# EasyEDA Pro project ProPrj_RGB_AddOn.epro, schematic Schematic1

## Sheets
1 Matrix: Board Name: Board1; Create Date: 2026-03-03; Page Name: Matrix; Project Name: RGB_AddOn; Schematic Name: Schematic1; Update Date: 2026-03-03; Company: EasyEDA.com; Page Size: A4; Version: V1.0
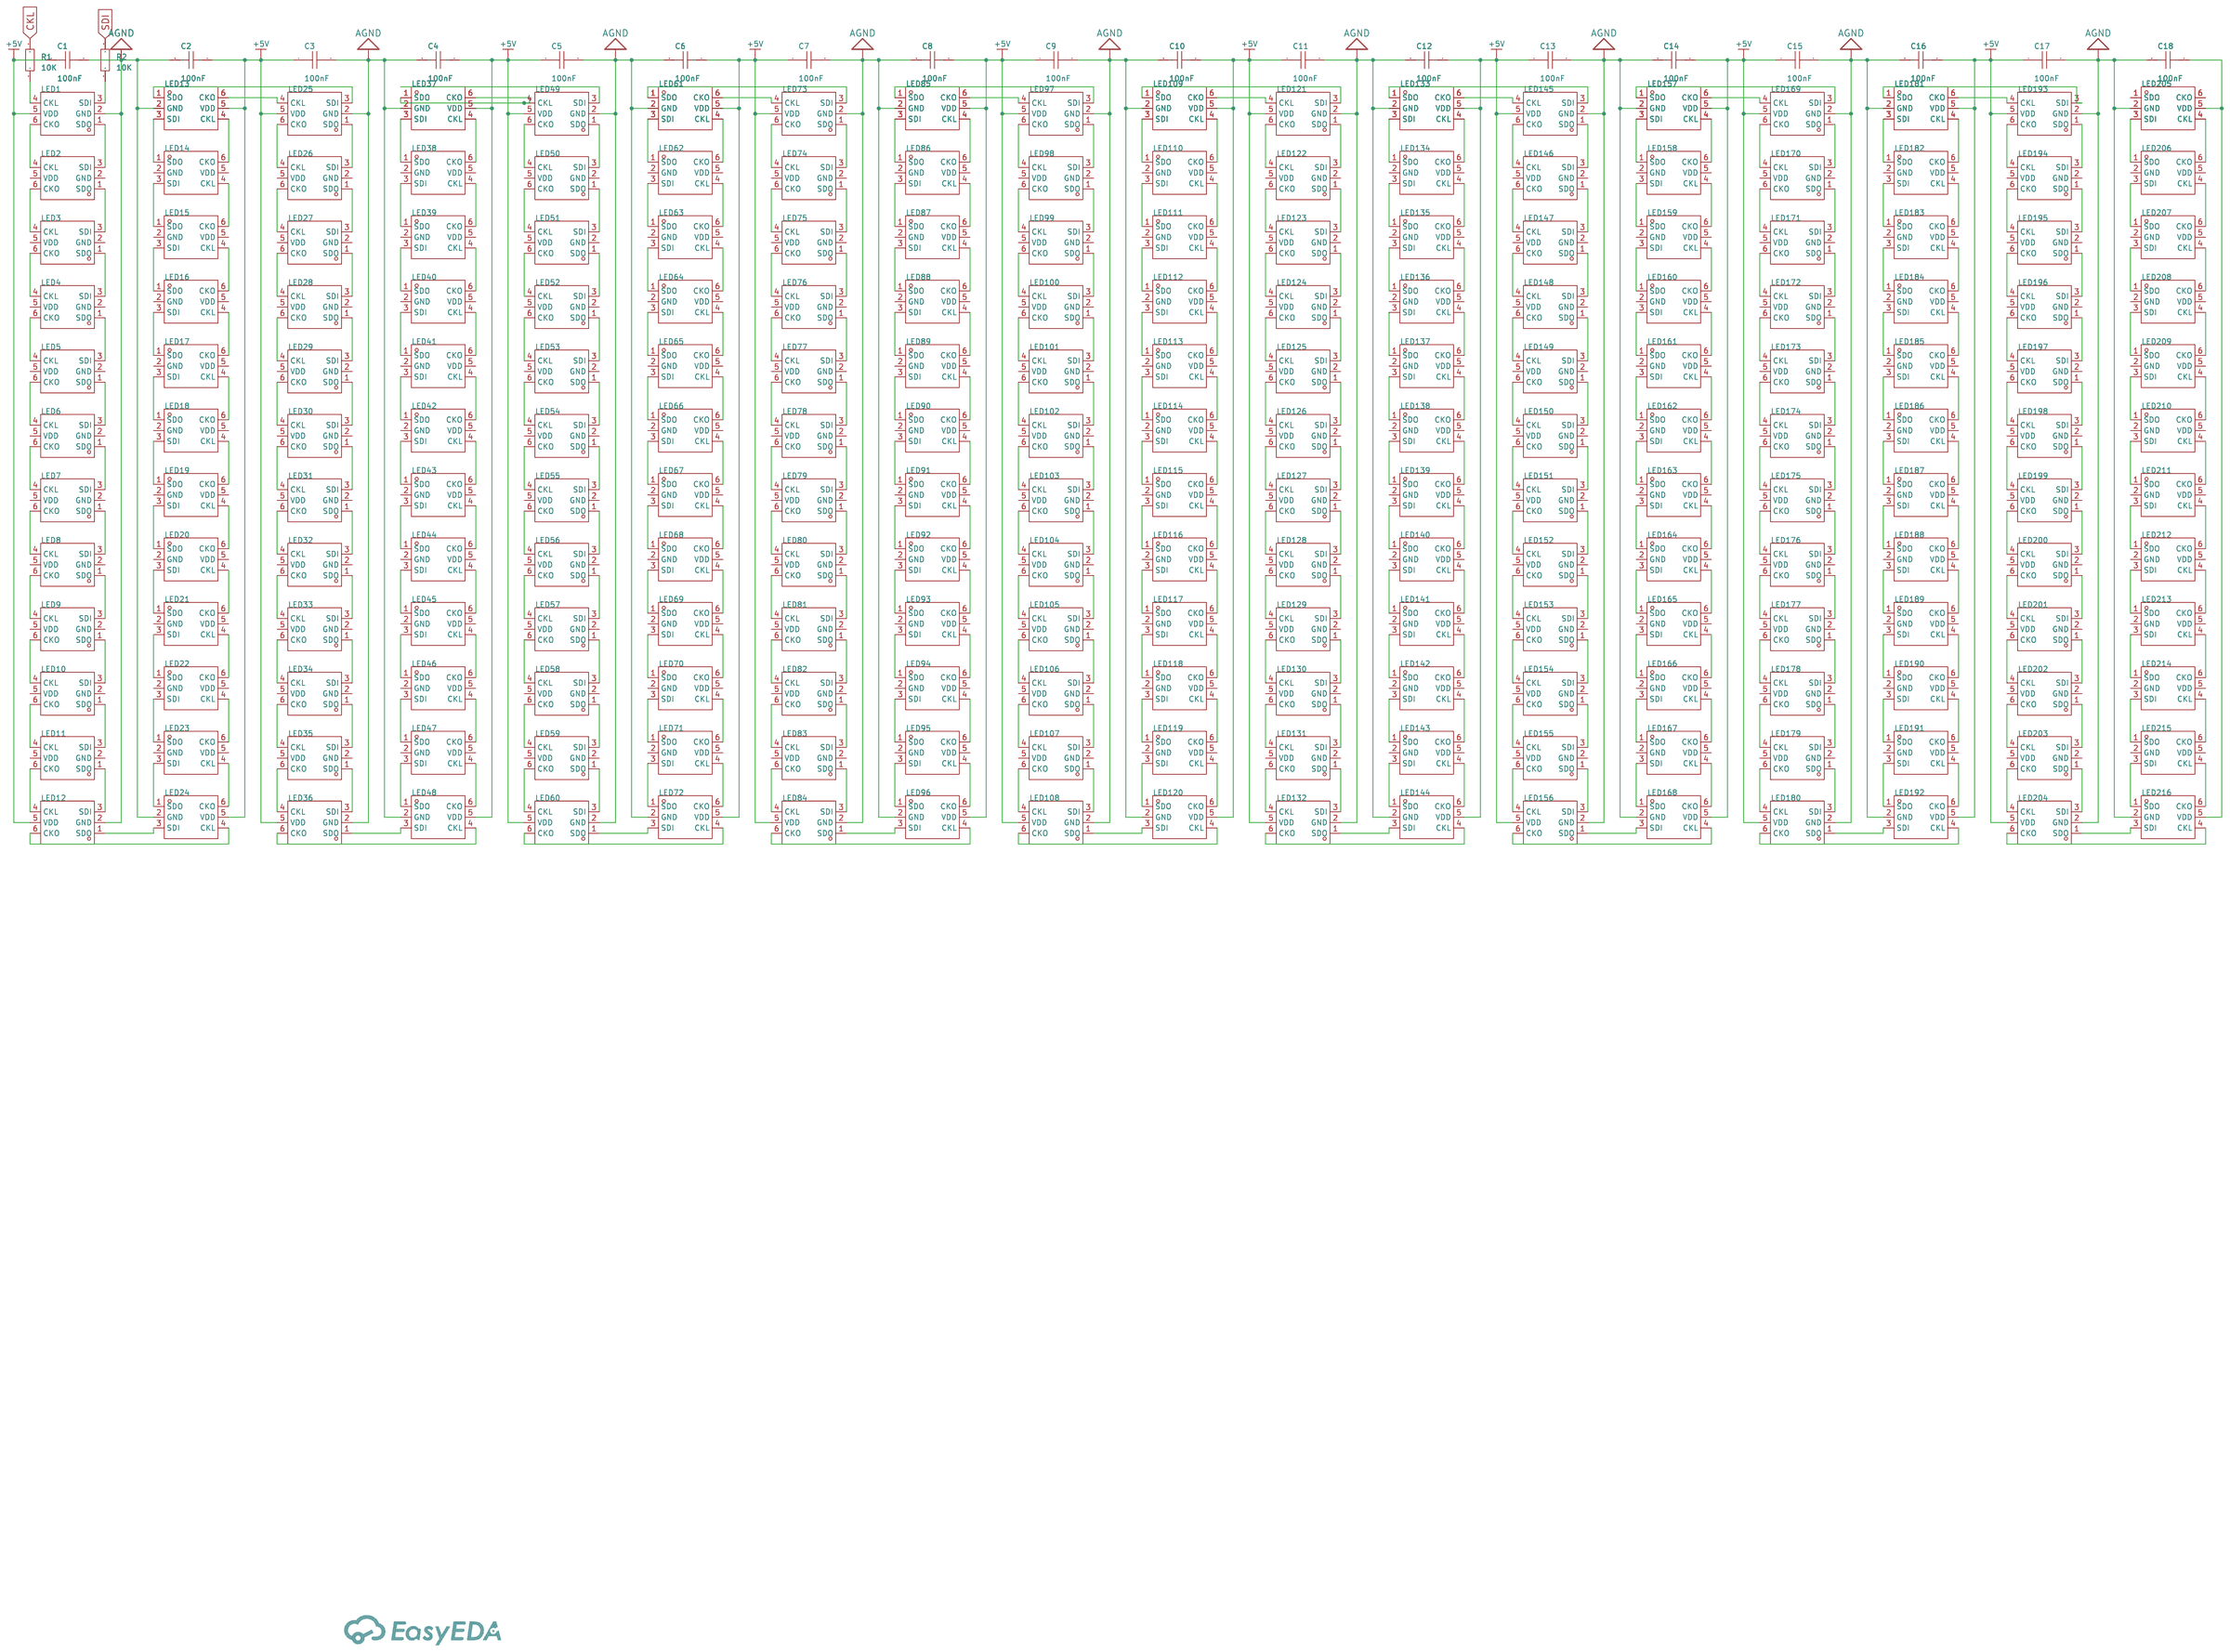
[diagram p0: Matrix]
2 MCU: Create Date: 2026-03-02; Page Name: MCU
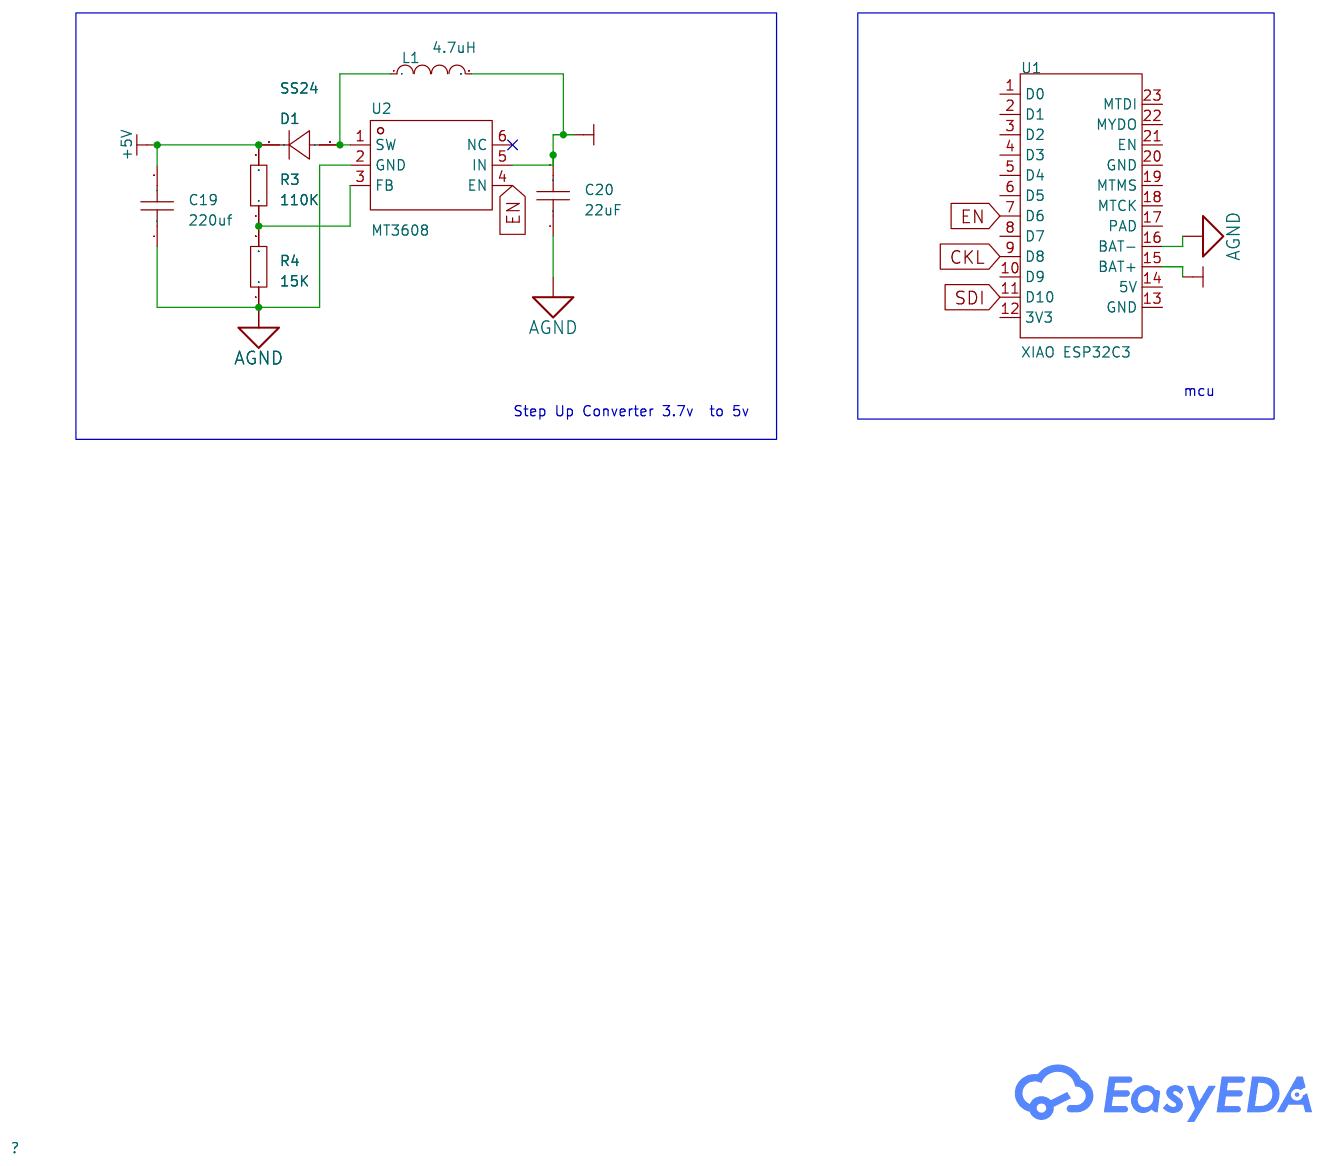
[diagram p1: MCU]

## Parts
sheet Matrix
C1  100nF  [C0603]
C2  100nF  [C0603]
C3  100nF  [C0603]
C4  100nF  [C0603]
C5  100nF  [C0603]
C6  100nF  [C0603]
C7  100nF  [C0603]
C8  100nF  [C0603]
C9  100nF  [C0603]
C10  100nF  [C0603]
C11  100nF  [C0603]
C12  100nF  [C0603]
C13  100nF  [C0603]
C14  100nF  [C0603]
C15  100nF  [C0603]
C16  100nF  [C0603]
C17  100nF  [C0603]
C18  100nF  [C0603]
LED1  SK9822-EC20  [LED-SMD_6P-L2.0-W2.0-P0.80-TL]
LED2  SK9822-EC20  [LED-SMD_6P-L2.0-W2.0-P0.80-TL]
LED3  SK9822-EC20  [LED-SMD_6P-L2.0-W2.0-P0.80-TL]
LED4  SK9822-EC20  [LED-SMD_6P-L2.0-W2.0-P0.80-TL]
LED5  SK9822-EC20  [LED-SMD_6P-L2.0-W2.0-P0.80-TL]
LED6  SK9822-EC20  [LED-SMD_6P-L2.0-W2.0-P0.80-TL]
LED7  SK9822-EC20  [LED-SMD_6P-L2.0-W2.0-P0.80-TL]
LED8  SK9822-EC20  [LED-SMD_6P-L2.0-W2.0-P0.80-TL]
LED9  SK9822-EC20  [LED-SMD_6P-L2.0-W2.0-P0.80-TL]
LED10  SK9822-EC20  [LED-SMD_6P-L2.0-W2.0-P0.80-TL]
LED11  SK9822-EC20  [LED-SMD_6P-L2.0-W2.0-P0.80-TL]
LED12  SK9822-EC20  [LED-SMD_6P-L2.0-W2.0-P0.80-TL]
LED13  SK9822-EC20  [LED-SMD_6P-L2.0-W2.0-P0.80-TL]
LED14  SK9822-EC20  [LED-SMD_6P-L2.0-W2.0-P0.80-TL]
LED15  SK9822-EC20  [LED-SMD_6P-L2.0-W2.0-P0.80-TL]
LED16  SK9822-EC20  [LED-SMD_6P-L2.0-W2.0-P0.80-TL]
LED17  SK9822-EC20  [LED-SMD_6P-L2.0-W2.0-P0.80-TL]
LED18  SK9822-EC20  [LED-SMD_6P-L2.0-W2.0-P0.80-TL]
LED19  SK9822-EC20  [LED-SMD_6P-L2.0-W2.0-P0.80-TL]
LED20  SK9822-EC20  [LED-SMD_6P-L2.0-W2.0-P0.80-TL]
LED21  SK9822-EC20  [LED-SMD_6P-L2.0-W2.0-P0.80-TL]
LED22  SK9822-EC20  [LED-SMD_6P-L2.0-W2.0-P0.80-TL]
LED23  SK9822-EC20  [LED-SMD_6P-L2.0-W2.0-P0.80-TL]
LED24  SK9822-EC20  [LED-SMD_6P-L2.0-W2.0-P0.80-TL]
LED25  SK9822-EC20  [LED-SMD_6P-L2.0-W2.0-P0.80-TL]
LED26  SK9822-EC20  [LED-SMD_6P-L2.0-W2.0-P0.80-TL]
LED27  SK9822-EC20  [LED-SMD_6P-L2.0-W2.0-P0.80-TL]
LED28  SK9822-EC20  [LED-SMD_6P-L2.0-W2.0-P0.80-TL]
LED29  SK9822-EC20  [LED-SMD_6P-L2.0-W2.0-P0.80-TL]
LED30  SK9822-EC20  [LED-SMD_6P-L2.0-W2.0-P0.80-TL]
LED31  SK9822-EC20  [LED-SMD_6P-L2.0-W2.0-P0.80-TL]
LED32  SK9822-EC20  [LED-SMD_6P-L2.0-W2.0-P0.80-TL]
LED33  SK9822-EC20  [LED-SMD_6P-L2.0-W2.0-P0.80-TL]
LED34  SK9822-EC20  [LED-SMD_6P-L2.0-W2.0-P0.80-TL]
LED35  SK9822-EC20  [LED-SMD_6P-L2.0-W2.0-P0.80-TL]
LED36  SK9822-EC20  [LED-SMD_6P-L2.0-W2.0-P0.80-TL]
LED37  SK9822-EC20  [LED-SMD_6P-L2.0-W2.0-P0.80-TL]
LED38  SK9822-EC20  [LED-SMD_6P-L2.0-W2.0-P0.80-TL]
LED39  SK9822-EC20  [LED-SMD_6P-L2.0-W2.0-P0.80-TL]
LED40  SK9822-EC20  [LED-SMD_6P-L2.0-W2.0-P0.80-TL]
LED41  SK9822-EC20  [LED-SMD_6P-L2.0-W2.0-P0.80-TL]
LED42  SK9822-EC20  [LED-SMD_6P-L2.0-W2.0-P0.80-TL]
LED43  SK9822-EC20  [LED-SMD_6P-L2.0-W2.0-P0.80-TL]
LED44  SK9822-EC20  [LED-SMD_6P-L2.0-W2.0-P0.80-TL]
LED45  SK9822-EC20  [LED-SMD_6P-L2.0-W2.0-P0.80-TL]
LED46  SK9822-EC20  [LED-SMD_6P-L2.0-W2.0-P0.80-TL]
LED47  SK9822-EC20  [LED-SMD_6P-L2.0-W2.0-P0.80-TL]
LED48  SK9822-EC20  [LED-SMD_6P-L2.0-W2.0-P0.80-TL]
LED49  SK9822-EC20  [LED-SMD_6P-L2.0-W2.0-P0.80-TL]
LED50  SK9822-EC20  [LED-SMD_6P-L2.0-W2.0-P0.80-TL]
LED51  SK9822-EC20  [LED-SMD_6P-L2.0-W2.0-P0.80-TL]
LED52  SK9822-EC20  [LED-SMD_6P-L2.0-W2.0-P0.80-TL]
LED53  SK9822-EC20  [LED-SMD_6P-L2.0-W2.0-P0.80-TL]
LED54  SK9822-EC20  [LED-SMD_6P-L2.0-W2.0-P0.80-TL]
LED55  SK9822-EC20  [LED-SMD_6P-L2.0-W2.0-P0.80-TL]
LED56  SK9822-EC20  [LED-SMD_6P-L2.0-W2.0-P0.80-TL]
LED57  SK9822-EC20  [LED-SMD_6P-L2.0-W2.0-P0.80-TL]
LED58  SK9822-EC20  [LED-SMD_6P-L2.0-W2.0-P0.80-TL]
LED59  SK9822-EC20  [LED-SMD_6P-L2.0-W2.0-P0.80-TL]
LED60  SK9822-EC20  [LED-SMD_6P-L2.0-W2.0-P0.80-TL]
LED61  SK9822-EC20  [LED-SMD_6P-L2.0-W2.0-P0.80-TL]
LED62  SK9822-EC20  [LED-SMD_6P-L2.0-W2.0-P0.80-TL]
LED63  SK9822-EC20  [LED-SMD_6P-L2.0-W2.0-P0.80-TL]
LED64  SK9822-EC20  [LED-SMD_6P-L2.0-W2.0-P0.80-TL]
LED65  SK9822-EC20  [LED-SMD_6P-L2.0-W2.0-P0.80-TL]
LED66  SK9822-EC20  [LED-SMD_6P-L2.0-W2.0-P0.80-TL]
LED67  SK9822-EC20  [LED-SMD_6P-L2.0-W2.0-P0.80-TL]
LED68  SK9822-EC20  [LED-SMD_6P-L2.0-W2.0-P0.80-TL]
LED69  SK9822-EC20  [LED-SMD_6P-L2.0-W2.0-P0.80-TL]
LED70  SK9822-EC20  [LED-SMD_6P-L2.0-W2.0-P0.80-TL]
LED71  SK9822-EC20  [LED-SMD_6P-L2.0-W2.0-P0.80-TL]
LED72  SK9822-EC20  [LED-SMD_6P-L2.0-W2.0-P0.80-TL]
LED73  SK9822-EC20  [LED-SMD_6P-L2.0-W2.0-P0.80-TL]
LED74  SK9822-EC20  [LED-SMD_6P-L2.0-W2.0-P0.80-TL]
LED75  SK9822-EC20  [LED-SMD_6P-L2.0-W2.0-P0.80-TL]
LED76  SK9822-EC20  [LED-SMD_6P-L2.0-W2.0-P0.80-TL]
LED77  SK9822-EC20  [LED-SMD_6P-L2.0-W2.0-P0.80-TL]
LED78  SK9822-EC20  [LED-SMD_6P-L2.0-W2.0-P0.80-TL]
LED79  SK9822-EC20  [LED-SMD_6P-L2.0-W2.0-P0.80-TL]
LED80  SK9822-EC20  [LED-SMD_6P-L2.0-W2.0-P0.80-TL]
LED81  SK9822-EC20  [LED-SMD_6P-L2.0-W2.0-P0.80-TL]
LED82  SK9822-EC20  [LED-SMD_6P-L2.0-W2.0-P0.80-TL]
LED83  SK9822-EC20  [LED-SMD_6P-L2.0-W2.0-P0.80-TL]
LED84  SK9822-EC20  [LED-SMD_6P-L2.0-W2.0-P0.80-TL]
LED85  SK9822-EC20  [LED-SMD_6P-L2.0-W2.0-P0.80-TL]
LED86  SK9822-EC20  [LED-SMD_6P-L2.0-W2.0-P0.80-TL]
LED87  SK9822-EC20  [LED-SMD_6P-L2.0-W2.0-P0.80-TL]
LED88  SK9822-EC20  [LED-SMD_6P-L2.0-W2.0-P0.80-TL]
LED89  SK9822-EC20  [LED-SMD_6P-L2.0-W2.0-P0.80-TL]
LED90  SK9822-EC20  [LED-SMD_6P-L2.0-W2.0-P0.80-TL]
LED91  SK9822-EC20  [LED-SMD_6P-L2.0-W2.0-P0.80-TL]
LED92  SK9822-EC20  [LED-SMD_6P-L2.0-W2.0-P0.80-TL]
LED93  SK9822-EC20  [LED-SMD_6P-L2.0-W2.0-P0.80-TL]
LED94  SK9822-EC20  [LED-SMD_6P-L2.0-W2.0-P0.80-TL]
LED95  SK9822-EC20  [LED-SMD_6P-L2.0-W2.0-P0.80-TL]
LED96  SK9822-EC20  [LED-SMD_6P-L2.0-W2.0-P0.80-TL]
LED97  SK9822-EC20  [LED-SMD_6P-L2.0-W2.0-P0.80-TL]
LED98  SK9822-EC20  [LED-SMD_6P-L2.0-W2.0-P0.80-TL]
LED99  SK9822-EC20  [LED-SMD_6P-L2.0-W2.0-P0.80-TL]
LED100  SK9822-EC20  [LED-SMD_6P-L2.0-W2.0-P0.80-TL]
LED101  SK9822-EC20  [LED-SMD_6P-L2.0-W2.0-P0.80-TL]
LED102  SK9822-EC20  [LED-SMD_6P-L2.0-W2.0-P0.80-TL]
LED103  SK9822-EC20  [LED-SMD_6P-L2.0-W2.0-P0.80-TL]
LED104  SK9822-EC20  [LED-SMD_6P-L2.0-W2.0-P0.80-TL]
LED105  SK9822-EC20  [LED-SMD_6P-L2.0-W2.0-P0.80-TL]
LED106  SK9822-EC20  [LED-SMD_6P-L2.0-W2.0-P0.80-TL]
LED107  SK9822-EC20  [LED-SMD_6P-L2.0-W2.0-P0.80-TL]
LED108  SK9822-EC20  [LED-SMD_6P-L2.0-W2.0-P0.80-TL]
LED109  SK9822-EC20  [LED-SMD_6P-L2.0-W2.0-P0.80-TL]
LED110  SK9822-EC20  [LED-SMD_6P-L2.0-W2.0-P0.80-TL]
LED111  SK9822-EC20  [LED-SMD_6P-L2.0-W2.0-P0.80-TL]
LED112  SK9822-EC20  [LED-SMD_6P-L2.0-W2.0-P0.80-TL]
LED113  SK9822-EC20  [LED-SMD_6P-L2.0-W2.0-P0.80-TL]
LED114  SK9822-EC20  [LED-SMD_6P-L2.0-W2.0-P0.80-TL]
LED115  SK9822-EC20  [LED-SMD_6P-L2.0-W2.0-P0.80-TL]
LED116  SK9822-EC20  [LED-SMD_6P-L2.0-W2.0-P0.80-TL]
LED117  SK9822-EC20  [LED-SMD_6P-L2.0-W2.0-P0.80-TL]
LED118  SK9822-EC20  [LED-SMD_6P-L2.0-W2.0-P0.80-TL]
LED119  SK9822-EC20  [LED-SMD_6P-L2.0-W2.0-P0.80-TL]
LED120  SK9822-EC20  [LED-SMD_6P-L2.0-W2.0-P0.80-TL]
LED121  SK9822-EC20  [LED-SMD_6P-L2.0-W2.0-P0.80-TL]
LED122  SK9822-EC20  [LED-SMD_6P-L2.0-W2.0-P0.80-TL]
LED123  SK9822-EC20  [LED-SMD_6P-L2.0-W2.0-P0.80-TL]
LED124  SK9822-EC20  [LED-SMD_6P-L2.0-W2.0-P0.80-TL]
LED125  SK9822-EC20  [LED-SMD_6P-L2.0-W2.0-P0.80-TL]
LED126  SK9822-EC20  [LED-SMD_6P-L2.0-W2.0-P0.80-TL]
LED127  SK9822-EC20  [LED-SMD_6P-L2.0-W2.0-P0.80-TL]
LED128  SK9822-EC20  [LED-SMD_6P-L2.0-W2.0-P0.80-TL]
LED129  SK9822-EC20  [LED-SMD_6P-L2.0-W2.0-P0.80-TL]
LED130  SK9822-EC20  [LED-SMD_6P-L2.0-W2.0-P0.80-TL]
LED131  SK9822-EC20  [LED-SMD_6P-L2.0-W2.0-P0.80-TL]
LED132  SK9822-EC20  [LED-SMD_6P-L2.0-W2.0-P0.80-TL]
LED133  SK9822-EC20  [LED-SMD_6P-L2.0-W2.0-P0.80-TL]
LED134  SK9822-EC20  [LED-SMD_6P-L2.0-W2.0-P0.80-TL]
LED135  SK9822-EC20  [LED-SMD_6P-L2.0-W2.0-P0.80-TL]
LED136  SK9822-EC20  [LED-SMD_6P-L2.0-W2.0-P0.80-TL]
LED137  SK9822-EC20  [LED-SMD_6P-L2.0-W2.0-P0.80-TL]
LED138  SK9822-EC20  [LED-SMD_6P-L2.0-W2.0-P0.80-TL]
LED139  SK9822-EC20  [LED-SMD_6P-L2.0-W2.0-P0.80-TL]
LED140  SK9822-EC20  [LED-SMD_6P-L2.0-W2.0-P0.80-TL]
LED141  SK9822-EC20  [LED-SMD_6P-L2.0-W2.0-P0.80-TL]
LED142  SK9822-EC20  [LED-SMD_6P-L2.0-W2.0-P0.80-TL]
LED143  SK9822-EC20  [LED-SMD_6P-L2.0-W2.0-P0.80-TL]
LED144  SK9822-EC20  [LED-SMD_6P-L2.0-W2.0-P0.80-TL]
LED145  SK9822-EC20  [LED-SMD_6P-L2.0-W2.0-P0.80-TL]
LED146  SK9822-EC20  [LED-SMD_6P-L2.0-W2.0-P0.80-TL]
LED147  SK9822-EC20  [LED-SMD_6P-L2.0-W2.0-P0.80-TL]
LED148  SK9822-EC20  [LED-SMD_6P-L2.0-W2.0-P0.80-TL]
LED149  SK9822-EC20  [LED-SMD_6P-L2.0-W2.0-P0.80-TL]
LED150  SK9822-EC20  [LED-SMD_6P-L2.0-W2.0-P0.80-TL]
LED151  SK9822-EC20  [LED-SMD_6P-L2.0-W2.0-P0.80-TL]
LED152  SK9822-EC20  [LED-SMD_6P-L2.0-W2.0-P0.80-TL]
LED153  SK9822-EC20  [LED-SMD_6P-L2.0-W2.0-P0.80-TL]
LED154  SK9822-EC20  [LED-SMD_6P-L2.0-W2.0-P0.80-TL]
LED155  SK9822-EC20  [LED-SMD_6P-L2.0-W2.0-P0.80-TL]
LED156  SK9822-EC20  [LED-SMD_6P-L2.0-W2.0-P0.80-TL]
LED157  SK9822-EC20  [LED-SMD_6P-L2.0-W2.0-P0.80-TL]
LED158  SK9822-EC20  [LED-SMD_6P-L2.0-W2.0-P0.80-TL]
LED159  SK9822-EC20  [LED-SMD_6P-L2.0-W2.0-P0.80-TL]
LED160  SK9822-EC20  [LED-SMD_6P-L2.0-W2.0-P0.80-TL]
LED161  SK9822-EC20  [LED-SMD_6P-L2.0-W2.0-P0.80-TL]
LED162  SK9822-EC20  [LED-SMD_6P-L2.0-W2.0-P0.80-TL]
LED163  SK9822-EC20  [LED-SMD_6P-L2.0-W2.0-P0.80-TL]
LED164  SK9822-EC20  [LED-SMD_6P-L2.0-W2.0-P0.80-TL]
LED165  SK9822-EC20  [LED-SMD_6P-L2.0-W2.0-P0.80-TL]
LED166  SK9822-EC20  [LED-SMD_6P-L2.0-W2.0-P0.80-TL]
LED167  SK9822-EC20  [LED-SMD_6P-L2.0-W2.0-P0.80-TL]
LED168  SK9822-EC20  [LED-SMD_6P-L2.0-W2.0-P0.80-TL]
LED169  SK9822-EC20  [LED-SMD_6P-L2.0-W2.0-P0.80-TL]
LED170  SK9822-EC20  [LED-SMD_6P-L2.0-W2.0-P0.80-TL]
LED171  SK9822-EC20  [LED-SMD_6P-L2.0-W2.0-P0.80-TL]
LED172  SK9822-EC20  [LED-SMD_6P-L2.0-W2.0-P0.80-TL]
LED173  SK9822-EC20  [LED-SMD_6P-L2.0-W2.0-P0.80-TL]
LED174  SK9822-EC20  [LED-SMD_6P-L2.0-W2.0-P0.80-TL]
LED175  SK9822-EC20  [LED-SMD_6P-L2.0-W2.0-P0.80-TL]
LED176  SK9822-EC20  [LED-SMD_6P-L2.0-W2.0-P0.80-TL]
LED177  SK9822-EC20  [LED-SMD_6P-L2.0-W2.0-P0.80-TL]
LED178  SK9822-EC20  [LED-SMD_6P-L2.0-W2.0-P0.80-TL]
LED179  SK9822-EC20  [LED-SMD_6P-L2.0-W2.0-P0.80-TL]
LED180  SK9822-EC20  [LED-SMD_6P-L2.0-W2.0-P0.80-TL]
LED181  SK9822-EC20  [LED-SMD_6P-L2.0-W2.0-P0.80-TL]
LED182  SK9822-EC20  [LED-SMD_6P-L2.0-W2.0-P0.80-TL]
LED183  SK9822-EC20  [LED-SMD_6P-L2.0-W2.0-P0.80-TL]
LED184  SK9822-EC20  [LED-SMD_6P-L2.0-W2.0-P0.80-TL]
LED185  SK9822-EC20  [LED-SMD_6P-L2.0-W2.0-P0.80-TL]
LED186  SK9822-EC20  [LED-SMD_6P-L2.0-W2.0-P0.80-TL]
LED187  SK9822-EC20  [LED-SMD_6P-L2.0-W2.0-P0.80-TL]
LED188  SK9822-EC20  [LED-SMD_6P-L2.0-W2.0-P0.80-TL]
LED189  SK9822-EC20  [LED-SMD_6P-L2.0-W2.0-P0.80-TL]
LED190  SK9822-EC20  [LED-SMD_6P-L2.0-W2.0-P0.80-TL]
LED191  SK9822-EC20  [LED-SMD_6P-L2.0-W2.0-P0.80-TL]
LED192  SK9822-EC20  [LED-SMD_6P-L2.0-W2.0-P0.80-TL]
LED193  SK9822-EC20  [LED-SMD_6P-L2.0-W2.0-P0.80-TL]
LED194  SK9822-EC20  [LED-SMD_6P-L2.0-W2.0-P0.80-TL]
LED195  SK9822-EC20  [LED-SMD_6P-L2.0-W2.0-P0.80-TL]
LED196  SK9822-EC20  [LED-SMD_6P-L2.0-W2.0-P0.80-TL]
LED197  SK9822-EC20  [LED-SMD_6P-L2.0-W2.0-P0.80-TL]
LED198  SK9822-EC20  [LED-SMD_6P-L2.0-W2.0-P0.80-TL]
LED199  SK9822-EC20  [LED-SMD_6P-L2.0-W2.0-P0.80-TL]
LED200  SK9822-EC20  [LED-SMD_6P-L2.0-W2.0-P0.80-TL]
LED201  SK9822-EC20  [LED-SMD_6P-L2.0-W2.0-P0.80-TL]
LED202  SK9822-EC20  [LED-SMD_6P-L2.0-W2.0-P0.80-TL]
LED203  SK9822-EC20  [LED-SMD_6P-L2.0-W2.0-P0.80-TL]
LED204  SK9822-EC20  [LED-SMD_6P-L2.0-W2.0-P0.80-TL]
LED205  SK9822-EC20  [LED-SMD_6P-L2.0-W2.0-P0.80-TL]
LED206  SK9822-EC20  [LED-SMD_6P-L2.0-W2.0-P0.80-TL]
LED207  SK9822-EC20  [LED-SMD_6P-L2.0-W2.0-P0.80-TL]
LED208  SK9822-EC20  [LED-SMD_6P-L2.0-W2.0-P0.80-TL]
LED209  SK9822-EC20  [LED-SMD_6P-L2.0-W2.0-P0.80-TL]
LED210  SK9822-EC20  [LED-SMD_6P-L2.0-W2.0-P0.80-TL]
LED211  SK9822-EC20  [LED-SMD_6P-L2.0-W2.0-P0.80-TL]
LED212  SK9822-EC20  [LED-SMD_6P-L2.0-W2.0-P0.80-TL]
LED213  SK9822-EC20  [LED-SMD_6P-L2.0-W2.0-P0.80-TL]
LED214  SK9822-EC20  [LED-SMD_6P-L2.0-W2.0-P0.80-TL]
LED215  SK9822-EC20  [LED-SMD_6P-L2.0-W2.0-P0.80-TL]
LED216  SK9822-EC20  [LED-SMD_6P-L2.0-W2.0-P0.80-TL]
R1  10K  [R0603]
R2  10K  [R0603]
sheet MCU
C19  220uf  [C0603]
C20  22uF  [C0603]
D1  SS24  [DO-214AC_L4.3-W2.7-LS5.2-RD]
L1  4.7uH  [L0603]
R3  110K  [R0603]
R4  15K  [R0603]
U1  XIAO ESP32C3  [CONN-SMD_113991054]
U2  MT3608  [SOT-23-6_L2.9-W1.6-P0.95-LS2.8-BL]

## Library data of the parts
C1-C20 = CAP_0603: Supplier Footprint: 0603
LED1-LED216 = SK9822-EC20: Wavelength:620nm~625nm；460nm~470nm；520nm~530nm Operating Temperature:-40℃~+80℃; LCSC Part Name: RGB三色; Supplier Part: C2909059; Manufacturer: 欧思科光电; Supplier Footprint: SMD,2x2mm; JLCPCB Part Class: Extended Part; Datasheet: https://item.szlcsc.com/datasheet/SK9822-EC20/3185287.html; Supplier: LCSC; Wavelength: 620nm~625nm；460nm~470nm；520nm~530nm; Operating Temperature: -40℃~+80℃
R1-R4 = Res_0603: Supplier Footprint: 0603
D1 = SS24_1: Diode Configuration:Independent Voltage - Forward(Vf@If):550mV@2.0A Voltage - DC Reverse(Vr):40V Current - Rectified:2A Reverse Leakage Current (Ir):5mA@40V; LCSC Part Name: 电压:40V 电流:2A; Supplier Part: C20609202; Manufacturer: JSMSEMI(杰盛微); Supplier Footprint: SMA(DO-214AC); Datasheet: https://item.szlcsc.com/datasheet/SS24/21959764.html; Supplier: LCSC; Diode Configuration: Independent; Voltage - Forward(Vf@If): 550mV@2.0A; Voltage - DC Reverse(Vr): 40V; Current - Rectified: 2A; Reverse Leakage Current (Ir): 5mA@40V
L1 = L_0603
U1 = XIAO ESP32C3: Supplier Part: C19189385; Supplier Footprint: QFN-32_5X5_EP3.7; Supplier: LCSC
U2 = MT3608: Function:Boost Output Type:Adjustable Voltage - Supply:2V~24V Voltage - Supply:2V~24V Output Voltage:- Output Voltage:- Output Current:2A Frequency - Switching:1.2MHz Frequency - Switching:1.2MHz Operating Temperature:-40℃~+85℃ Operating Temperature:-40℃~; LCSC Part Name: 老版本 高效1.2MHz 2A升压转换器; Supplier Part: C84817; Manufacturer: 西安航天民芯; Supplier Footprint: SOT-23-6; JLCPCB Part Class: Extended Part; Datasheet: https://item.szlcsc.com/datasheet/MT3608/85988.html; Supplier: LCSC; Function: Boost; Output Type: Adjustable; Voltage - Supply: 2V~24V; Output Current: 2A; Frequency - Switching: 1.2MHz; Operating Temperature: -40℃~+85℃; Synchronous Rectifier: No; Number of Outputs: 1; Topology: Boost; Quiescent Current: 100uA；1.6mA; Switch tube (built-in/external): Built-in

## Nets
+5V: C1.1 C2.1 C3.1 C4.1 C5.1 C6.1 C7.1 C8.1 C9.1 C10.1 C11.1 C12.1 C13.1 C14.1 C15.1 C16.1 C17.1 C19.2 D1.1(K) LED1.5(VDD) LED12.5(VDD) LED13.5(VDD) LED24.5(VDD) LED25.5(VDD) LED36.5(VDD) LED37.5(VDD) LED48.5(VDD) LED49.5(VDD) LED60.5(VDD) LED61.5(VDD) LED72.5(VDD) LED73.5(VDD) LED84.5(VDD) LED85.5(VDD) LED96.5(VDD) LED97.5(VDD) LED108.5(VDD) LED109.5(VDD) LED120.5(VDD) LED121.5(VDD) LED132.5(VDD) LED133.5(VDD) LED144.5(VDD) LED145.5(VDD) LED156.5(VDD) LED157.5(VDD) LED168.5(VDD) LED169.5(VDD) LED180.5(VDD) LED181.5(VDD) LED192.5(VDD) LED193.5(VDD) LED204.5(VDD) R3.2
AGND: C1.2 C2.2 C3.2 C4.2 C5.2 C6.2 C7.2 C8.2 C9.2 C10.2 C11.2 C12.2 C13.2 C14.2 C15.2 C16.2 C17.2 C18.2 C19.1 C20.1 LED1.2(GND) LED12.2(GND) LED13.2(GND) LED24.2(GND) LED25.2(GND) LED36.2(GND) LED37.2(GND) LED48.2(GND) LED49.2(GND) LED60.2(GND) LED61.2(GND) LED72.2(GND) LED73.2(GND) LED84.2(GND) LED85.2(GND) LED96.2(GND) LED97.2(GND) LED108.2(GND) LED109.2(GND) LED120.2(GND) LED121.2(GND) LED132.2(GND) LED133.2(GND) LED144.2(GND) LED145.2(GND) LED156.2(GND) LED157.2(GND) LED168.2(GND) LED169.2(GND) LED180.2(GND) LED181.2(GND) LED192.2(GND) LED193.2(GND) LED204.2(GND) LED205.2(GND) LED216.2(GND) R4.1 U1.16(BAT-) U2.2(GND)
VBAT(3.7V): C20.2 L1.2 U1.15(BAT+) U2.5(IN)
CKL: R1.2 U1.9(D8)
EN: U1.7(D6) U2.4(EN)
SDI: R2.2 U1.11(D10)
$1N2153: LED203.6(CKO) LED204.4(CKL)
$1N2157: LED202.6(CKO) LED203.4(CKL)
$1N2162: LED201.6(CKO) LED202.4(CKL)
$1N2167: LED200.6(CKO) LED201.4(CKL)
$1N2172: LED199.6(CKO) LED200.4(CKL)
$1N2177: LED198.6(CKO) LED199.4(CKL)
$1N2182: LED197.6(CKO) LED198.4(CKL)
$1N2187: LED196.6(CKO) LED197.4(CKL)
$1N2192: LED195.6(CKO) LED196.4(CKL)
$1N2197: LED194.6(CKO) LED195.4(CKL)
$1N2202: LED193.6(CKO) LED194.4(CKL)
$1N2207: LED193.1(SDO) LED194.3(SDI)
$1N2212: LED194.1(SDO) LED195.3(SDI)
$1N2217: LED195.1(SDO) LED196.3(SDI)
$1N2222: LED196.1(SDO) LED197.3(SDI)
$1N2227: LED197.1(SDO) LED198.3(SDI)
$1N2232: LED198.1(SDO) LED199.3(SDI)
$1N2253: LED199.1(SDO) LED200.3(SDI)
$1N2257: LED200.1(SDO) LED201.3(SDI)
$1N2262: LED201.1(SDO) LED202.3(SDI)
$1N2267: LED202.1(SDO) LED203.3(SDI)
$1N2275: LED203.1(SDO) LED204.3(SDI)
$1N2916: LED205.4(CKL) LED206.6(CKO)
$1N2918: LED206.4(CKL) LED207.6(CKO)
$1N2920: LED207.4(CKL) LED208.6(CKO)
$1N2922: LED208.4(CKL) LED209.6(CKO)
$1N2924: LED209.4(CKL) LED210.6(CKO)
$1N2926: LED210.4(CKL) LED211.6(CKO)
$1N2928: LED211.4(CKL) LED212.6(CKO)
$1N2930: LED212.4(CKL) LED213.6(CKO)
$1N2932: LED213.4(CKL) LED214.6(CKO)
$1N2934: LED214.4(CKL) LED215.6(CKO)
$1N2936: LED215.4(CKL) LED216.6(CKO)
$1N2938: LED215.3(SDI) LED216.1(SDO)
$1N2940: LED214.3(SDI) LED215.1(SDO)
$1N2942: LED213.3(SDI) LED214.1(SDO)
$1N2944: LED212.3(SDI) LED213.1(SDO)
$1N2946: LED211.3(SDI) LED212.1(SDO)
$1N2948: LED210.3(SDI) LED211.1(SDO)
$1N2950: LED209.3(SDI) LED210.1(SDO)
$1N2952: LED208.3(SDI) LED209.1(SDO)
$1N2954: LED207.3(SDI) LED208.1(SDO)
$1N2956: LED206.3(SDI) LED207.1(SDO)
$1N2958: LED205.3(SDI) LED206.1(SDO)
$1N2960: C18.1 LED205.5(VDD) LED216.5(VDD)
$1N79936: LED179.6(CKO) LED180.4(CKL)
$1N79939: LED178.6(CKO) LED179.4(CKL)
$1N79942: LED177.6(CKO) LED178.4(CKL)
$1N79945: LED176.6(CKO) LED177.4(CKL)
$1N79948: LED175.6(CKO) LED176.4(CKL)
$1N79951: LED174.6(CKO) LED175.4(CKL)
$1N79954: LED173.6(CKO) LED174.4(CKL)
$1N79957: LED172.6(CKO) LED173.4(CKL)
$1N79960: LED171.6(CKO) LED172.4(CKL)
$1N79963: LED170.6(CKO) LED171.4(CKL)
$1N79966: LED169.6(CKO) LED170.4(CKL)
$1N79969: LED169.1(SDO) LED170.3(SDI)
$1N79972: LED170.1(SDO) LED171.3(SDI)
$1N79975: LED171.1(SDO) LED172.3(SDI)
$1N79978: LED172.1(SDO) LED173.3(SDI)
$1N79981: LED173.1(SDO) LED174.3(SDI)
$1N79984: LED174.1(SDO) LED175.3(SDI)
$1N79987: LED175.1(SDO) LED176.3(SDI)
$1N79990: LED176.1(SDO) LED177.3(SDI)
$1N79993: LED177.1(SDO) LED178.3(SDI)
$1N79996: LED178.1(SDO) LED179.3(SDI)
$1N79999: LED179.1(SDO) LED180.3(SDI)
$1N80018: LED181.4(CKL) LED182.6(CKO)
$1N80020: LED182.4(CKL) LED183.6(CKO)
$1N80022: LED183.4(CKL) LED184.6(CKO)
$1N80024: LED184.4(CKL) LED185.6(CKO)
$1N80026: LED185.4(CKL) LED186.6(CKO)
$1N80028: LED186.4(CKL) LED187.6(CKO)
$1N80030: LED187.4(CKL) LED188.6(CKO)
$1N80032: LED188.4(CKL) LED189.6(CKO)
$1N80034: LED189.4(CKL) LED190.6(CKO)
$1N80036: LED190.4(CKL) LED191.6(CKO)
$1N80038: LED191.4(CKL) LED192.6(CKO)
$1N80040: LED191.3(SDI) LED192.1(SDO)
$1N80042: LED190.3(SDI) LED191.1(SDO)
$1N80044: LED189.3(SDI) LED190.1(SDO)
$1N80046: LED188.3(SDI) LED189.1(SDO)
$1N80048: LED187.3(SDI) LED188.1(SDO)
$1N80050: LED186.3(SDI) LED187.1(SDO)
$1N80052: LED185.3(SDI) LED186.1(SDO)
$1N80054: LED184.3(SDI) LED185.1(SDO)
$1N80070: LED181.3(SDI) LED182.1(SDO)
$1N80072: LED182.3(SDI) LED183.1(SDO)
$1N80074: LED183.3(SDI) LED184.1(SDO)
$1N81180: LED155.6(CKO) LED156.4(CKL)
$1N81183: LED154.6(CKO) LED155.4(CKL)
$1N81186: LED153.6(CKO) LED154.4(CKL)
$1N81189: LED152.6(CKO) LED153.4(CKL)
$1N81192: LED151.6(CKO) LED152.4(CKL)
$1N81195: LED150.6(CKO) LED151.4(CKL)
$1N81198: LED149.6(CKO) LED150.4(CKL)
$1N81201: LED148.6(CKO) LED149.4(CKL)
$1N81204: LED147.6(CKO) LED148.4(CKL)
$1N81207: LED146.6(CKO) LED147.4(CKL)
$1N81210: LED145.6(CKO) LED146.4(CKL)
$1N81213: LED145.1(SDO) LED146.3(SDI)
$1N81216: LED146.1(SDO) LED147.3(SDI)
$1N81219: LED147.1(SDO) LED148.3(SDI)
$1N81222: LED148.1(SDO) LED149.3(SDI)
$1N81225: LED149.1(SDO) LED150.3(SDI)
$1N81228: LED150.1(SDO) LED151.3(SDI)
$1N81231: LED151.1(SDO) LED152.3(SDI)
$1N81234: LED152.1(SDO) LED153.3(SDI)
$1N81237: LED153.1(SDO) LED154.3(SDI)
$1N81240: LED154.1(SDO) LED155.3(SDI)
$1N81243: LED155.1(SDO) LED156.3(SDI)
$1N81262: LED157.4(CKL) LED158.6(CKO)
$1N81264: LED158.4(CKL) LED159.6(CKO)
$1N81266: LED159.4(CKL) LED160.6(CKO)
$1N81268: LED160.4(CKL) LED161.6(CKO)
$1N81270: LED161.4(CKL) LED162.6(CKO)
$1N81272: LED162.4(CKL) LED163.6(CKO)
$1N81274: LED163.4(CKL) LED164.6(CKO)
$1N81276: LED164.4(CKL) LED165.6(CKO)
$1N81278: LED165.4(CKL) LED166.6(CKO)
$1N81280: LED166.4(CKL) LED167.6(CKO)
$1N81282: LED167.4(CKL) LED168.6(CKO)
$1N81284: LED167.3(SDI) LED168.1(SDO)
$1N81286: LED166.3(SDI) LED167.1(SDO)
$1N81288: LED165.3(SDI) LED166.1(SDO)
$1N81290: LED164.3(SDI) LED165.1(SDO)
$1N81292: LED163.3(SDI) LED164.1(SDO)
$1N81294: LED162.3(SDI) LED163.1(SDO)
$1N81296: LED161.3(SDI) LED162.1(SDO)
$1N81298: LED160.3(SDI) LED161.1(SDO)
$1N81314: LED157.3(SDI) LED158.1(SDO)
$1N81316: LED158.3(SDI) LED159.1(SDO)
$1N81318: LED159.3(SDI) LED160.1(SDO)
$1N82424: LED131.6(CKO) LED132.4(CKL)
$1N82427: LED130.6(CKO) LED131.4(CKL)
$1N82430: LED129.6(CKO) LED130.4(CKL)
$1N82433: LED128.6(CKO) LED129.4(CKL)
$1N82436: LED127.6(CKO) LED128.4(CKL)
$1N82439: LED126.6(CKO) LED127.4(CKL)
$1N82442: LED125.6(CKO) LED126.4(CKL)
$1N82445: LED124.6(CKO) LED125.4(CKL)
$1N82448: LED123.6(CKO) LED124.4(CKL)
$1N82451: LED122.6(CKO) LED123.4(CKL)
$1N82454: LED121.6(CKO) LED122.4(CKL)
$1N82457: LED121.1(SDO) LED122.3(SDI)
$1N82460: LED122.1(SDO) LED123.3(SDI)
$1N82463: LED123.1(SDO) LED124.3(SDI)
$1N82466: LED124.1(SDO) LED125.3(SDI)
$1N82469: LED125.1(SDO) LED126.3(SDI)
$1N82472: LED126.1(SDO) LED127.3(SDI)
$1N82475: LED127.1(SDO) LED128.3(SDI)
$1N82478: LED128.1(SDO) LED129.3(SDI)
$1N82481: LED129.1(SDO) LED130.3(SDI)
$1N82484: LED130.1(SDO) LED131.3(SDI)
$1N82487: LED131.1(SDO) LED132.3(SDI)
$1N82506: LED133.4(CKL) LED134.6(CKO)
$1N82508: LED134.4(CKL) LED135.6(CKO)
$1N82510: LED135.4(CKL) LED136.6(CKO)
$1N82512: LED136.4(CKL) LED137.6(CKO)
$1N82514: LED137.4(CKL) LED138.6(CKO)
$1N82516: LED138.4(CKL) LED139.6(CKO)
$1N82518: LED139.4(CKL) LED140.6(CKO)
$1N82520: LED140.4(CKL) LED141.6(CKO)
$1N82522: LED141.4(CKL) LED142.6(CKO)
$1N82524: LED142.4(CKL) LED143.6(CKO)
$1N82526: LED143.4(CKL) LED144.6(CKO)
$1N82528: LED143.3(SDI) LED144.1(SDO)
$1N82530: LED142.3(SDI) LED143.1(SDO)
$1N82532: LED141.3(SDI) LED142.1(SDO)
$1N82534: LED140.3(SDI) LED141.1(SDO)
$1N82536: LED139.3(SDI) LED140.1(SDO)
$1N82538: LED138.3(SDI) LED139.1(SDO)
$1N82540: LED137.3(SDI) LED138.1(SDO)
$1N82542: LED136.3(SDI) LED137.1(SDO)
$1N82558: LED133.3(SDI) LED134.1(SDO)
$1N82560: LED134.3(SDI) LED135.1(SDO)
$1N82562: LED135.3(SDI) LED136.1(SDO)
$1N83668: LED107.6(CKO) LED108.4(CKL)
$1N83671: LED106.6(CKO) LED107.4(CKL)
$1N83674: LED105.6(CKO) LED106.4(CKL)
$1N83677: LED104.6(CKO) LED105.4(CKL)
$1N83680: LED103.6(CKO) LED104.4(CKL)
$1N83683: LED102.6(CKO) LED103.4(CKL)
$1N83686: LED101.6(CKO) LED102.4(CKL)
$1N83689: LED100.6(CKO) LED101.4(CKL)
$1N83692: LED99.6(CKO) LED100.4(CKL)
$1N83695: LED98.6(CKO) LED99.4(CKL)
$1N83698: LED97.6(CKO) LED98.4(CKL)
$1N83701: LED97.1(SDO) LED98.3(SDI)
$1N83704: LED98.1(SDO) LED99.3(SDI)
$1N83707: LED99.1(SDO) LED100.3(SDI)
$1N83710: LED100.1(SDO) LED101.3(SDI)
$1N83713: LED101.1(SDO) LED102.3(SDI)
$1N83716: LED102.1(SDO) LED103.3(SDI)
$1N83719: LED103.1(SDO) LED104.3(SDI)
$1N83722: LED104.1(SDO) LED105.3(SDI)
$1N83725: LED105.1(SDO) LED106.3(SDI)
$1N83728: LED106.1(SDO) LED107.3(SDI)
$1N83731: LED107.1(SDO) LED108.3(SDI)
$1N83750: LED109.4(CKL) LED110.6(CKO)
$1N83752: LED110.4(CKL) LED111.6(CKO)
$1N83754: LED111.4(CKL) LED112.6(CKO)
$1N83756: LED112.4(CKL) LED113.6(CKO)
$1N83758: LED113.4(CKL) LED114.6(CKO)
$1N83760: LED114.4(CKL) LED115.6(CKO)
$1N83762: LED115.4(CKL) LED116.6(CKO)
$1N83764: LED116.4(CKL) LED117.6(CKO)
$1N83766: LED117.4(CKL) LED118.6(CKO)
$1N83768: LED118.4(CKL) LED119.6(CKO)
$1N83770: LED119.4(CKL) LED120.6(CKO)
$1N83772: LED119.3(SDI) LED120.1(SDO)
$1N83774: LED118.3(SDI) LED119.1(SDO)
$1N83776: LED117.3(SDI) LED118.1(SDO)
$1N83778: LED116.3(SDI) LED117.1(SDO)
$1N83780: LED115.3(SDI) LED116.1(SDO)
$1N83782: LED114.3(SDI) LED115.1(SDO)
$1N83784: LED113.3(SDI) LED114.1(SDO)
$1N83786: LED112.3(SDI) LED113.1(SDO)
$1N83802: LED109.3(SDI) LED110.1(SDO)
$1N83804: LED110.3(SDI) LED111.1(SDO)
$1N83806: LED111.3(SDI) LED112.1(SDO)
$1N84912: LED83.6(CKO) LED84.4(CKL)
$1N84915: LED82.6(CKO) LED83.4(CKL)
$1N84918: LED81.6(CKO) LED82.4(CKL)
$1N84921: LED80.6(CKO) LED81.4(CKL)
$1N84924: LED79.6(CKO) LED80.4(CKL)
$1N84927: LED78.6(CKO) LED79.4(CKL)
$1N84930: LED77.6(CKO) LED78.4(CKL)
$1N84933: LED76.6(CKO) LED77.4(CKL)
$1N84936: LED75.6(CKO) LED76.4(CKL)
$1N84939: LED74.6(CKO) LED75.4(CKL)
$1N84942: LED73.6(CKO) LED74.4(CKL)
$1N84945: LED73.1(SDO) LED74.3(SDI)
$1N84948: LED74.1(SDO) LED75.3(SDI)
$1N84951: LED75.1(SDO) LED76.3(SDI)
$1N84954: LED76.1(SDO) LED77.3(SDI)
$1N84957: LED77.1(SDO) LED78.3(SDI)
$1N84960: LED78.1(SDO) LED79.3(SDI)
$1N84963: LED79.1(SDO) LED80.3(SDI)
$1N84966: LED80.1(SDO) LED81.3(SDI)
$1N84969: LED81.1(SDO) LED82.3(SDI)
$1N84972: LED82.1(SDO) LED83.3(SDI)
$1N84975: LED83.1(SDO) LED84.3(SDI)
$1N84994: LED85.4(CKL) LED86.6(CKO)
$1N84996: LED86.4(CKL) LED87.6(CKO)
$1N84998: LED87.4(CKL) LED88.6(CKO)
$1N85000: LED88.4(CKL) LED89.6(CKO)
$1N85002: LED89.4(CKL) LED90.6(CKO)
$1N85004: LED90.4(CKL) LED91.6(CKO)
$1N85006: LED91.4(CKL) LED92.6(CKO)
$1N85008: LED92.4(CKL) LED93.6(CKO)
$1N85010: LED93.4(CKL) LED94.6(CKO)
$1N85012: LED94.4(CKL) LED95.6(CKO)
$1N85014: LED95.4(CKL) LED96.6(CKO)
$1N85016: LED95.3(SDI) LED96.1(SDO)
$1N85018: LED94.3(SDI) LED95.1(SDO)
$1N85020: LED93.3(SDI) LED94.1(SDO)
$1N85022: LED92.3(SDI) LED93.1(SDO)
$1N85024: LED91.3(SDI) LED92.1(SDO)
$1N85026: LED90.3(SDI) LED91.1(SDO)
$1N85028: LED89.3(SDI) LED90.1(SDO)
$1N85030: LED88.3(SDI) LED89.1(SDO)
$1N85046: LED85.3(SDI) LED86.1(SDO)
$1N85048: LED86.3(SDI) LED87.1(SDO)
$1N85050: LED87.3(SDI) LED88.1(SDO)
$1N86156: LED59.6(CKO) LED60.4(CKL)
$1N86159: LED58.6(CKO) LED59.4(CKL)
$1N86162: LED57.6(CKO) LED58.4(CKL)
$1N86165: LED56.6(CKO) LED57.4(CKL)
$1N86168: LED55.6(CKO) LED56.4(CKL)
$1N86171: LED54.6(CKO) LED55.4(CKL)
$1N86174: LED53.6(CKO) LED54.4(CKL)
$1N86177: LED52.6(CKO) LED53.4(CKL)
$1N86180: LED51.6(CKO) LED52.4(CKL)
$1N86183: LED50.6(CKO) LED51.4(CKL)
$1N86186: LED49.6(CKO) LED50.4(CKL)
$1N86189: LED49.1(SDO) LED50.3(SDI)
$1N86192: LED50.1(SDO) LED51.3(SDI)
$1N86195: LED51.1(SDO) LED52.3(SDI)
$1N86198: LED52.1(SDO) LED53.3(SDI)
$1N86201: LED53.1(SDO) LED54.3(SDI)
$1N86204: LED54.1(SDO) LED55.3(SDI)
$1N86207: LED55.1(SDO) LED56.3(SDI)
$1N86210: LED56.1(SDO) LED57.3(SDI)
$1N86213: LED57.1(SDO) LED58.3(SDI)
$1N86216: LED58.1(SDO) LED59.3(SDI)
$1N86219: LED59.1(SDO) LED60.3(SDI)
$1N86238: LED61.4(CKL) LED62.6(CKO)
$1N86240: LED62.4(CKL) LED63.6(CKO)
$1N86242: LED63.4(CKL) LED64.6(CKO)
$1N86244: LED64.4(CKL) LED65.6(CKO)
$1N86246: LED65.4(CKL) LED66.6(CKO)
$1N86248: LED66.4(CKL) LED67.6(CKO)
$1N86250: LED67.4(CKL) LED68.6(CKO)
$1N86252: LED68.4(CKL) LED69.6(CKO)
$1N86254: LED69.4(CKL) LED70.6(CKO)
$1N86256: LED70.4(CKL) LED71.6(CKO)
$1N86258: LED71.4(CKL) LED72.6(CKO)
$1N86260: LED71.3(SDI) LED72.1(SDO)
$1N86262: LED70.3(SDI) LED71.1(SDO)
$1N86264: LED69.3(SDI) LED70.1(SDO)
$1N86266: LED68.3(SDI) LED69.1(SDO)
$1N86268: LED67.3(SDI) LED68.1(SDO)
$1N86270: LED66.3(SDI) LED67.1(SDO)
$1N86272: LED65.3(SDI) LED66.1(SDO)
$1N86274: LED64.3(SDI) LED65.1(SDO)
$1N86290: LED61.3(SDI) LED62.1(SDO)
$1N86292: LED62.3(SDI) LED63.1(SDO)
$1N86294: LED63.3(SDI) LED64.1(SDO)
$1N87400: LED35.6(CKO) LED36.4(CKL)
$1N87403: LED34.6(CKO) LED35.4(CKL)
$1N87406: LED33.6(CKO) LED34.4(CKL)
$1N87409: LED32.6(CKO) LED33.4(CKL)
$1N87412: LED31.6(CKO) LED32.4(CKL)
$1N87415: LED30.6(CKO) LED31.4(CKL)
$1N87418: LED29.6(CKO) LED30.4(CKL)
$1N87421: LED28.6(CKO) LED29.4(CKL)
$1N87424: LED27.6(CKO) LED28.4(CKL)
$1N87427: LED26.6(CKO) LED27.4(CKL)
$1N87430: LED25.6(CKO) LED26.4(CKL)
$1N87433: LED25.1(SDO) LED26.3(SDI)
$1N87436: LED26.1(SDO) LED27.3(SDI)
$1N87439: LED27.1(SDO) LED28.3(SDI)
$1N87442: LED28.1(SDO) LED29.3(SDI)
$1N87445: LED29.1(SDO) LED30.3(SDI)
$1N87448: LED30.1(SDO) LED31.3(SDI)
$1N87451: LED31.1(SDO) LED32.3(SDI)
$1N87454: LED32.1(SDO) LED33.3(SDI)
$1N87457: LED33.1(SDO) LED34.3(SDI)
$1N87460: LED34.1(SDO) LED35.3(SDI)
$1N87463: LED35.1(SDO) LED36.3(SDI)
$1N87482: LED37.4(CKL) LED38.6(CKO)
$1N87484: LED38.4(CKL) LED39.6(CKO)
$1N87486: LED39.4(CKL) LED40.6(CKO)
$1N87488: LED40.4(CKL) LED41.6(CKO)
$1N87490: LED41.4(CKL) LED42.6(CKO)
$1N87492: LED42.4(CKL) LED43.6(CKO)
$1N87494: LED43.4(CKL) LED44.6(CKO)
$1N87496: LED44.4(CKL) LED45.6(CKO)
$1N87498: LED45.4(CKL) LED46.6(CKO)
$1N87500: LED46.4(CKL) LED47.6(CKO)
$1N87502: LED47.4(CKL) LED48.6(CKO)
$1N87504: LED47.3(SDI) LED48.1(SDO)
$1N87506: LED46.3(SDI) LED47.1(SDO)
$1N87508: LED45.3(SDI) LED46.1(SDO)
$1N87510: LED44.3(SDI) LED45.1(SDO)
$1N87512: LED43.3(SDI) LED44.1(SDO)
$1N87514: LED42.3(SDI) LED43.1(SDO)
$1N87516: LED41.3(SDI) LED42.1(SDO)
$1N87518: LED40.3(SDI) LED41.1(SDO)
$1N87534: LED37.3(SDI) LED38.1(SDO)
$1N87536: LED38.3(SDI) LED39.1(SDO)
$1N87538: LED39.3(SDI) LED40.1(SDO)
$1N88644: LED11.6(CKO) LED12.4(CKL)
$1N88647: LED10.6(CKO) LED11.4(CKL)
$1N88650: LED9.6(CKO) LED10.4(CKL)
$1N88653: LED8.6(CKO) LED9.4(CKL)
$1N88656: LED7.6(CKO) LED8.4(CKL)
$1N88659: LED6.6(CKO) LED7.4(CKL)
$1N88662: LED5.6(CKO) LED6.4(CKL)
$1N88665: LED4.6(CKO) LED5.4(CKL)
$1N88668: LED3.6(CKO) LED4.4(CKL)
$1N88671: LED2.6(CKO) LED3.4(CKL)
$1N88674: LED1.6(CKO) LED2.4(CKL)
$1N88677: LED1.1(SDO) LED2.3(SDI)
$1N88680: LED2.1(SDO) LED3.3(SDI)
$1N88683: LED3.1(SDO) LED4.3(SDI)
$1N88686: LED4.1(SDO) LED5.3(SDI)
$1N88689: LED5.1(SDO) LED6.3(SDI)
$1N88692: LED6.1(SDO) LED7.3(SDI)
$1N88695: LED7.1(SDO) LED8.3(SDI)
$1N88698: LED8.1(SDO) LED9.3(SDI)
$1N88701: LED9.1(SDO) LED10.3(SDI)
$1N88704: LED10.1(SDO) LED11.3(SDI)
$1N88707: LED11.1(SDO) LED12.3(SDI)
$1N88726: LED13.4(CKL) LED14.6(CKO)
$1N88728: LED14.4(CKL) LED15.6(CKO)
$1N88730: LED15.4(CKL) LED16.6(CKO)
$1N88732: LED16.4(CKL) LED17.6(CKO)
$1N88734: LED17.4(CKL) LED18.6(CKO)
$1N88736: LED18.4(CKL) LED19.6(CKO)
$1N88738: LED19.4(CKL) LED20.6(CKO)
$1N88740: LED20.4(CKL) LED21.6(CKO)
$1N88742: LED21.4(CKL) LED22.6(CKO)
$1N88744: LED22.4(CKL) LED23.6(CKO)
$1N88746: LED23.4(CKL) LED24.6(CKO)
$1N88748: LED23.3(SDI) LED24.1(SDO)
$1N88750: LED22.3(SDI) LED23.1(SDO)
$1N88752: LED21.3(SDI) LED22.1(SDO)
$1N88754: LED20.3(SDI) LED21.1(SDO)
$1N88756: LED19.3(SDI) LED20.1(SDO)
$1N88758: LED18.3(SDI) LED19.1(SDO)
$1N88760: LED17.3(SDI) LED18.1(SDO)
$1N88762: LED16.3(SDI) LED17.1(SDO)
$1N88778: LED13.3(SDI) LED14.1(SDO)
$1N88780: LED14.3(SDI) LED15.1(SDO)
$1N88782: LED15.3(SDI) LED16.1(SDO)
$1N89197: LED12.1(SDO) LED24.3(SDI)
$1N89202: LED12.6(CKO) LED24.4(CKL)
$1N89209: LED36.1(SDO) LED48.3(SDI)
$1N89215: LED36.6(CKO) LED48.4(CKL)
$1N89222: LED60.1(SDO) LED72.3(SDI)
$1N89228: LED60.6(CKO) LED72.4(CKL)
$1N89235: LED84.1(SDO) LED96.3(SDI)
$1N89241: LED84.6(CKO) LED96.4(CKL)
$1N89248: LED108.1(SDO) LED120.3(SDI)
$1N89254: LED108.6(CKO) LED120.4(CKL)
$1N89261: LED132.1(SDO) LED144.3(SDI)
$1N89267: LED132.6(CKO) LED144.4(CKL)
$1N89274: LED156.1(SDO) LED168.3(SDI)
$1N89289: LED156.6(CKO) LED168.4(CKL)
$1N89299: LED180.1(SDO) LED192.3(SDI)
$1N89305: LED180.6(CKO) LED192.4(CKL)
$1N89312: LED204.1(SDO) LED216.3(SDI)
$1N89318: LED204.6(CKO) LED216.4(CKL)
$1N89325: LED13.6(CKO) LED25.4(CKL)
$1N89331: LED13.1(SDO) LED25.3(SDI)
$1N89338: LED37.1(SDO) LED37.6(CKO) LED49.4(CKL)
$1N89353: LED61.6(CKO) LED73.4(CKL)
$1N89359: LED61.1(SDO) LED73.3(SDI)
$1N89366: LED85.6(CKO) LED97.4(CKL)
$1N89372: LED85.1(SDO) LED97.3(SDI)
$1N89379: LED109.6(CKO) LED121.4(CKL)
$1N89385: LED109.1(SDO) LED121.3(SDI)
$1N89392: LED133.6(CKO) LED145.4(CKL)
$1N89398: LED133.1(SDO) LED145.3(SDI)
$1N89405: LED157.6(CKO) LED169.4(CKL)
$1N89411: LED157.1(SDO) LED169.3(SDI)
$1N89418: LED181.6(CKO) LED193.4(CKL)
$1N89424: LED181.1(SDO) LED193.3(SDI)
$1N89507: LED1.4(CKL) R1.1
$1N89511: LED1.3(SDI) R2.1
$2N815: D1.2(A) L1.1 U2.1(SW)
$2N825: R3.1 R4.2 U2.3(FB)

Not connected (* = marked no-connect by the designer): LED2 2(GND) 5(VDD); LED3 2(GND) 5(VDD); LED4 2(GND) 5(VDD); LED5 2(GND) 5(VDD); LED6 2(GND) 5(VDD); LED7 2(GND) 5(VDD); LED8 2(GND) 5(VDD); LED9 2(GND) 5(VDD); LED10 2(GND) 5(VDD); LED11 2(GND) 5(VDD); LED14 2(GND) 5(VDD); LED15 2(GND) 5(VDD); LED16 2(GND) 5(VDD); LED17 2(GND) 5(VDD); LED18 2(GND) 5(VDD); LED19 2(GND) 5(VDD); LED20 2(GND) 5(VDD); LED21 2(GND) 5(VDD); LED22 2(GND) 5(VDD); LED23 2(GND) 5(VDD); LED26 2(GND) 5(VDD); LED27 2(GND) 5(VDD); LED28 2(GND) 5(VDD); LED29 2(GND) 5(VDD); LED30 2(GND) 5(VDD); LED31 2(GND) 5(VDD); LED32 2(GND) 5(VDD); LED33 2(GND) 5(VDD); LED34 2(GND) 5(VDD); LED35 2(GND) 5(VDD); LED38 2(GND) 5(VDD); LED39 2(GND) 5(VDD); LED40 2(GND) 5(VDD); LED41 2(GND) 5(VDD); LED42 2(GND) 5(VDD); LED43 2(GND) 5(VDD); LED44 2(GND) 5(VDD); LED45 2(GND) 5(VDD); LED46 2(GND) 5(VDD); LED47 2(GND) 5(VDD); LED49 3(SDI); LED50 2(GND) 5(VDD); LED51 2(GND) 5(VDD); LED52 2(GND) 5(VDD); LED53 2(GND) 5(VDD); LED54 2(GND) 5(VDD); LED55 2(GND) 5(VDD); LED56 2(GND) 5(VDD); LED57 2(GND) 5(VDD); LED58 2(GND) 5(VDD); LED59 2(GND) 5(VDD); LED62 2(GND) 5(VDD); LED63 2(GND) 5(VDD); LED64 2(GND) 5(VDD); LED65 2(GND) 5(VDD); LED66 2(GND) 5(VDD); LED67 2(GND) 5(VDD); LED68 2(GND) 5(VDD); LED69 2(GND) 5(VDD); LED70 2(GND) 5(VDD); LED71 2(GND) 5(VDD); LED74 2(GND) 5(VDD); LED75 2(GND) 5(VDD); LED76 2(GND) 5(VDD); LED77 2(GND) 5(VDD); LED78 2(GND) 5(VDD); LED79 2(GND) 5(VDD); LED80 2(GND) 5(VDD); LED81 2(GND) 5(VDD); LED82 2(GND) 5(VDD); LED83 2(GND) 5(VDD); LED86 2(GND) 5(VDD); LED87 2(GND) 5(VDD); LED88 2(GND) 5(VDD); LED89 2(GND) 5(VDD); LED90 2(GND) 5(VDD); LED91 2(GND) 5(VDD); LED92 2(GND) 5(VDD); LED93 2(GND) 5(VDD); LED94 2(GND) 5(VDD); LED95 2(GND) 5(VDD); LED98 2(GND) 5(VDD); LED99 2(GND) 5(VDD); LED100 2(GND) 5(VDD); LED101 2(GND) 5(VDD); LED102 2(GND) 5(VDD); LED103 2(GND) 5(VDD); LED104 2(GND) 5(VDD); LED105 2(GND) 5(VDD); LED106 2(GND) 5(VDD); LED107 2(GND) 5(VDD); LED110 2(GND) 5(VDD); LED111 2(GND) 5(VDD); LED112 2(GND) 5(VDD); LED113 2(GND) 5(VDD); LED114 2(GND) 5(VDD); LED115 2(GND) 5(VDD); LED116 2(GND) 5(VDD); LED117 2(GND) 5(VDD); LED118 2(GND) 5(VDD); LED119 2(GND) 5(VDD); LED122 2(GND) 5(VDD); LED123 2(GND) 5(VDD); LED124 2(GND) 5(VDD); LED125 2(GND) 5(VDD); LED126 2(GND) 5(VDD); LED127 2(GND) 5(VDD); LED128 2(GND) 5(VDD); LED129 2(GND) 5(VDD); LED130 2(GND) 5(VDD); LED131 2(GND) 5(VDD); LED134 2(GND) 5(VDD); LED135 2(GND) 5(VDD); LED136 2(GND) 5(VDD); LED137 2(GND) 5(VDD); LED138 2(GND) 5(VDD); LED139 2(GND) 5(VDD); LED140 2(GND) 5(VDD); LED141 2(GND) 5(VDD); LED142 2(GND) 5(VDD); LED143 2(GND) 5(VDD); LED146 2(GND) 5(VDD); LED147 2(GND) 5(VDD); LED148 2(GND) 5(VDD); LED149 2(GND) 5(VDD); LED150 2(GND) 5(VDD); LED151 2(GND) 5(VDD); LED152 2(GND) 5(VDD); LED153 2(GND) 5(VDD); LED154 2(GND) 5(VDD); LED155 2(GND) 5(VDD); LED158 2(GND) 5(VDD); LED159 2(GND) 5(VDD); LED160 2(GND) 5(VDD); LED161 2(GND) 5(VDD); LED162 2(GND) 5(VDD); LED163 2(GND) 5(VDD); LED164 2(GND) 5(VDD); LED165 2(GND) 5(VDD); LED166 2(GND) 5(VDD); LED167 2(GND) 5(VDD); LED170 2(GND) 5(VDD); LED171 2(GND) 5(VDD); LED172 2(GND) 5(VDD); LED173 2(GND) 5(VDD); LED174 2(GND) 5(VDD); LED175 2(GND) 5(VDD); LED176 2(GND) 5(VDD); LED177 2(GND) 5(VDD); LED178 2(GND) 5(VDD); LED179 2(GND) 5(VDD); LED182 2(GND) 5(VDD); LED183 2(GND) 5(VDD); LED184 2(GND) 5(VDD); LED185 2(GND) 5(VDD); LED186 2(GND) 5(VDD); LED187 2(GND) 5(VDD); LED188 2(GND) 5(VDD); LED189 2(GND) 5(VDD); LED190 2(GND) 5(VDD); LED191 2(GND) 5(VDD); LED194 2(GND) 5(VDD); LED195 2(GND) 5(VDD); LED196 2(GND) 5(VDD); LED197 2(GND) 5(VDD); LED198 2(GND) 5(VDD); LED199 2(GND) 5(VDD); LED200 2(GND) 5(VDD); LED201 2(GND) 5(VDD); LED202 2(GND) 5(VDD); LED203 2(GND) 5(VDD); LED205 1(SDO) 6(CKO); LED206 2(GND) 5(VDD); LED207 2(GND) 5(VDD); LED208 2(GND) 5(VDD); LED209 2(GND) 5(VDD); LED210 2(GND) 5(VDD); LED211 2(GND) 5(VDD); LED212 2(GND) 5(VDD); LED213 2(GND) 5(VDD); LED214 2(GND) 5(VDD); LED215 2(GND) 5(VDD); U1 1(D0) 2(D1) 3(D2) 4(D3) 5(D4) 6(D5) 8(D7) 10(D9) 12(3V3) 13(GND) 14(5V) 17(PAD) 18(MTCK) 19(MTMS) 20(GND) 21(EN) 22(MYDO) 23(MTDI); U2 6(NC)*

## Notes on the sheets
sheet 2
- mcu
- Step Up Converter 3.7v  to 5v
